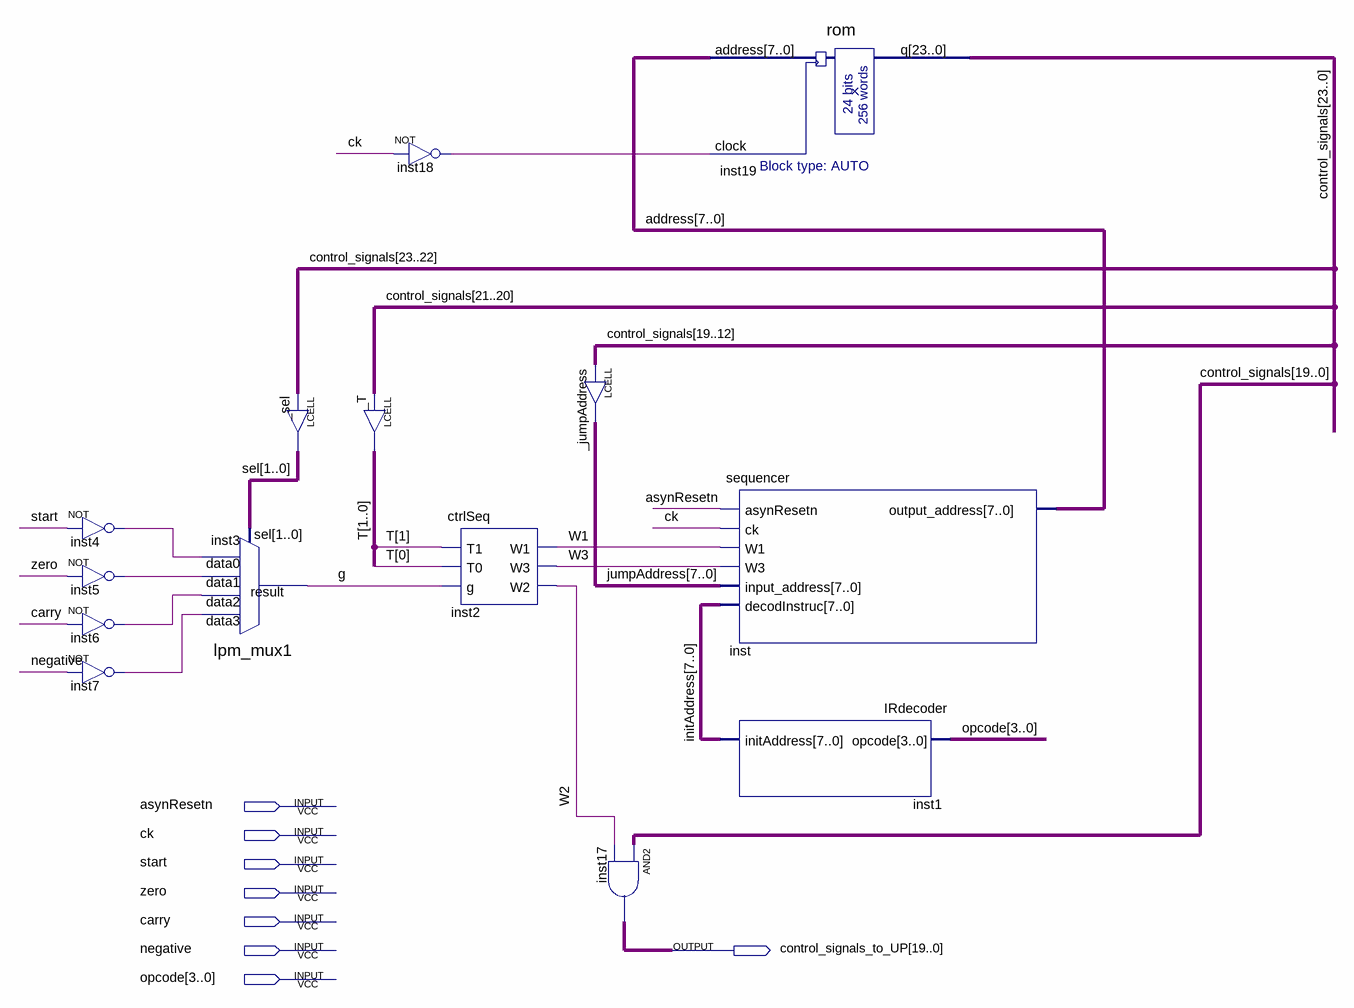
[diagram p0: schematic sheet]
// Quartus schematic UC.bdf as structural Verilog: 14 symbols, 8 pins
module UC (
  input  asynResetn,
  input  ck,
  input  start,
  input  zero,
  input  carry,
  input  negative,
  input  [3:0] opcode,
  output [19:0] control_signals_to_UP
);

  wire g, inst4_out, inst5_out, inst6_out, inst7_out, inst18_out, W1, W2, W3;
  wire [1:0] sel, T;
  wire [7:0] address, initAddress, jumpAddress;
  wire [23:0] control_signals;

  not inst4 (inst4_out, start);
  not inst5 (inst5_out, zero);
  not inst6 (inst6_out, carry);
  not inst7 (inst7_out, negative);
  lpm_mux1 inst3 (.data3(inst7_out), .data2(inst6_out), .data1(inst5_out), .data0(inst4_out), .sel(sel), .result(g));
  LCELL _sel[1:0] (.IN(control_signals[23:22]), .OUT(sel));
  not inst18 (inst18_out, ck);
  LCELL _T[1:0] (.IN(control_signals[21:20]), .OUT(T));
  ctrlSeq inst2 (.T1(T[1]), .T0(T[0]), .g(g), .W1(W1), .W2(W2), .W3(W3));
  LCELL _jumpAddress[7:0] (.IN(control_signals[19:12]), .OUT(jumpAddress));
  assign control_signals_to_UP = control_signals[19:0] & {20{W2}};  // AND2 inst17, 20 bits wide
  rom inst19 (.address(address), .clock(inst18_out), .q(control_signals));
  sequencer inst (
    .asynResetn(asynResetn), .ck(ck), .W1(W1), .W3(W3), .input_address(jumpAddress),
    .decodInstruc(initAddress), .output_address(address));
  IRdecoder inst1 (.opcode(opcode), .initAddress(initAddress));
endmodule
